# EAGLE design relay-set-d-decode (EAGLE 7.7.0)
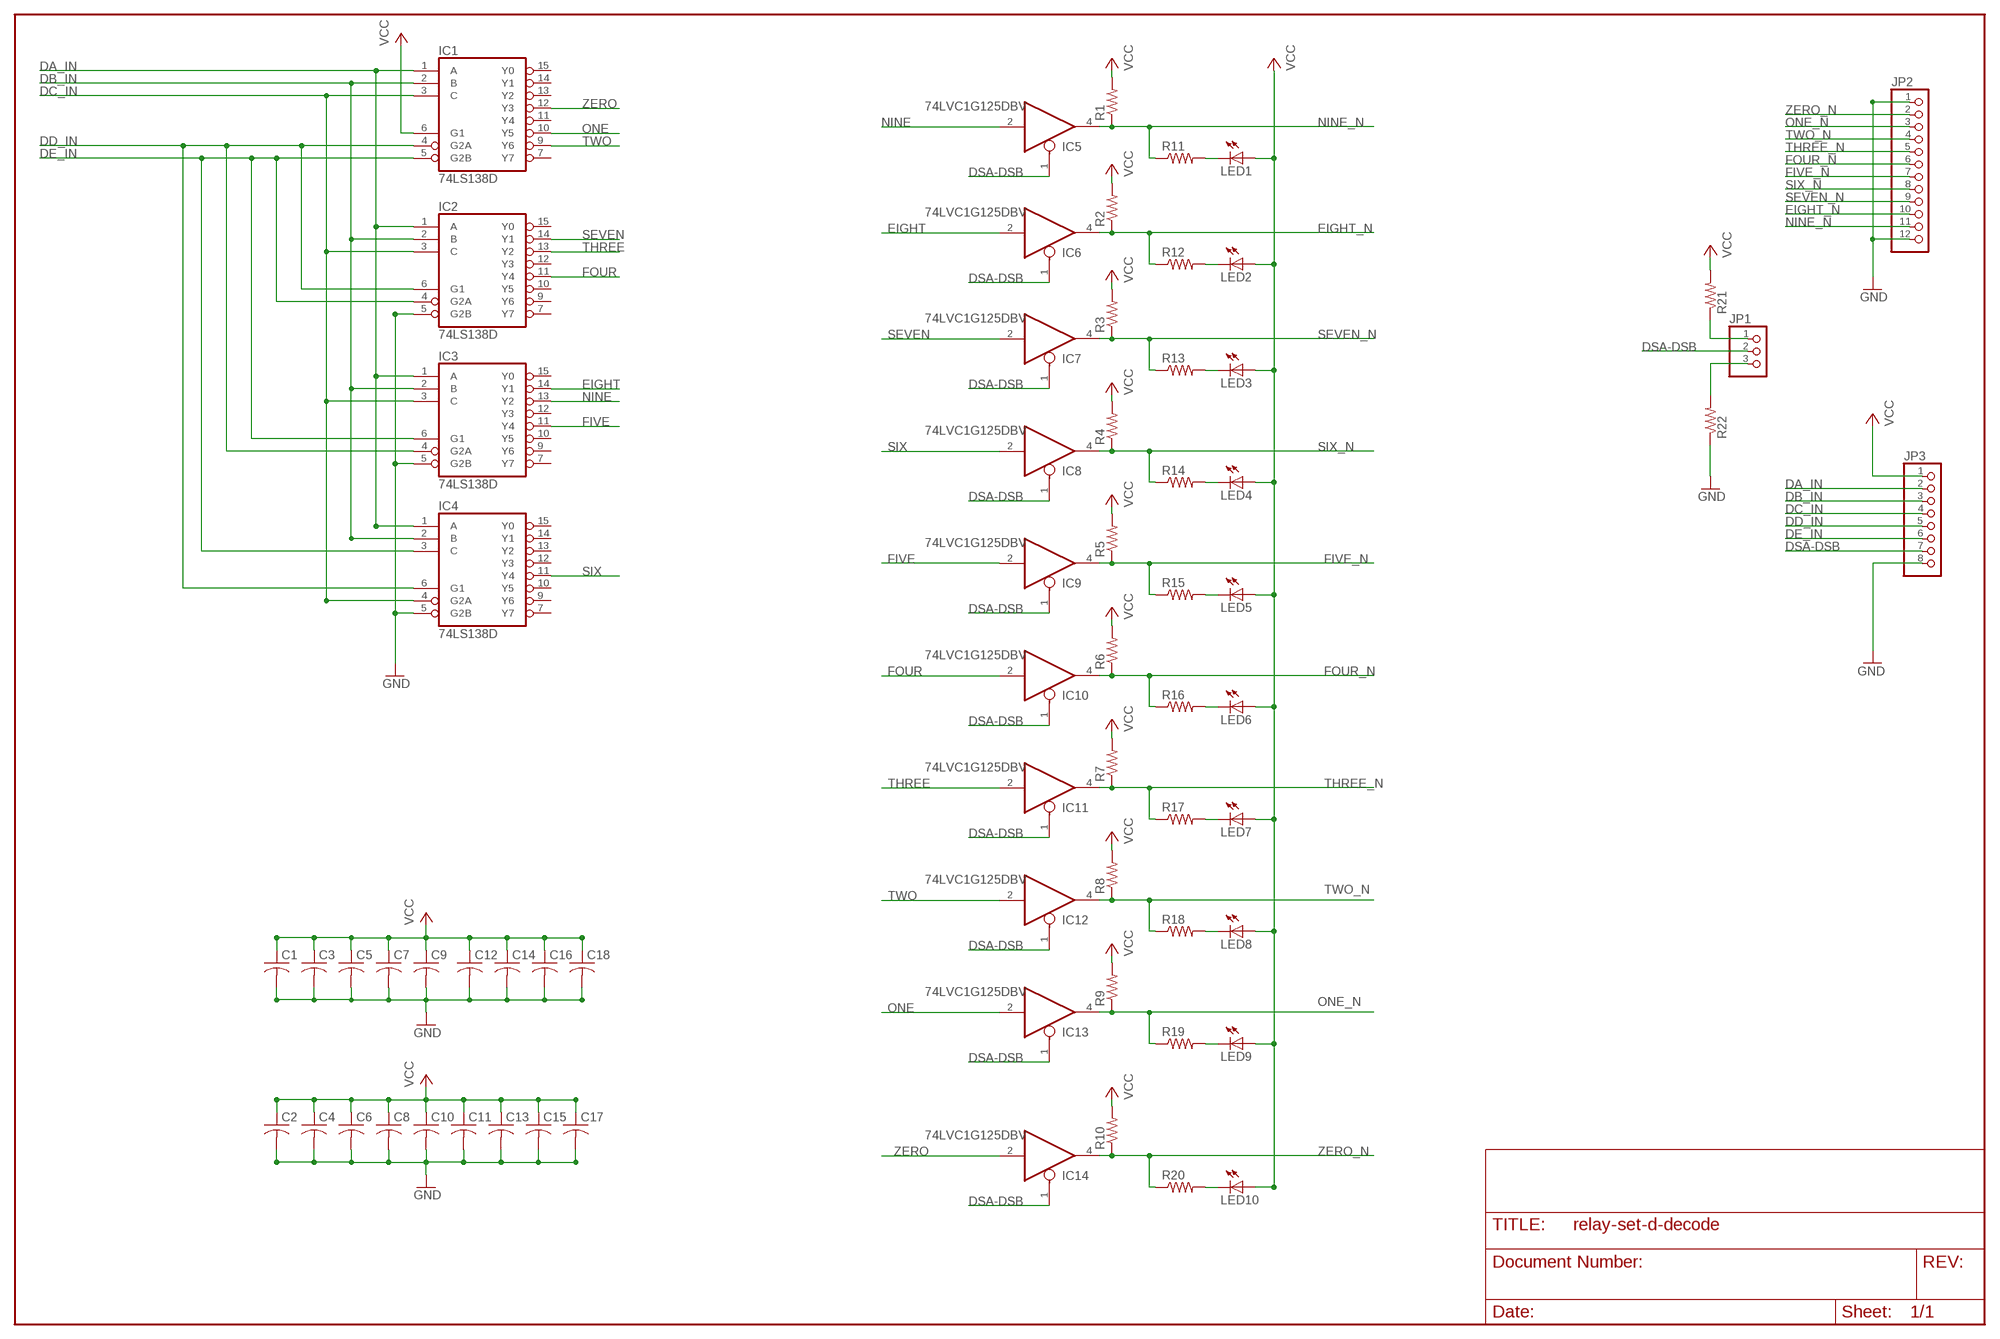
[diagram p0: schematic, sheet 1]

## Parts
C1  C-USC0603  [C0603]
C2  C-USC0603  [C0603]
C3  C-USC0603  [C0603]
C4  C-USC0603  [C0603]
C5  C-USC0805  [C0805]
C6  C-USC0603  [C0603]
C7  C-USC0805  [C0805]
C8  C-USC0603  [C0603]
C9  C-USC0805  [C0805]
C10  C-USC0603  [C0603]
C11  C-USC0603  [C0603]
C12  C-USC0603  [C0603]
C13  C-USC0603  [C0603]
C14  C-USC0603  [C0603]
C15  C-USC0603  [C0603]
C16  C-USC0603  [C0603]
C17  C-USC0603  [C0603]
C18  C-USC0603  [C0603]
IC1  74LS138D  [SO16]
IC2  74LS138D  [SO16]
IC3  74LS138D  [SO16]
IC4  74LS138D  [SO16]
IC5  74LVC1G125DBV  [SOT23-5]
IC6  74LVC1G125DBV  [SOT23-5]
IC7  74LVC1G125DBV  [SOT23-5]
IC8  74LVC1G125DBV  [SOT23-5]
IC9  74LVC1G125DBV  [SOT23-5]
IC10  74LVC1G125DBV  [SOT23-5]
IC11  74LVC1G125DBV  [SOT23-5]
IC12  74LVC1G125DBV  [SOT23-5]
IC13  74LVC1G125DBV  [SOT23-5]
IC14  74LVC1G125DBV  [SOT23-5]
JP1  PINHD-1X3  [1X03]
JP2  PINHD-1X12  [1X12]
JP3  PINHD-1X8  [1X08]
LED1  LEDCHIP-LED0805  [CHIP-LED0805]
LED2  LEDCHIP-LED0805  [CHIP-LED0805]
LED3  LEDCHIP-LED0805  [CHIP-LED0805]
LED4  LEDCHIP-LED0805  [CHIP-LED0805]
LED5  LEDCHIP-LED0805  [CHIP-LED0805]
LED6  LEDCHIP-LED0805  [CHIP-LED0805]
LED7  LEDCHIP-LED0805  [CHIP-LED0805]
LED8  LEDCHIP-LED0805  [CHIP-LED0805]
LED9  LEDCHIP-LED0805  [CHIP-LED0805]
LED10  LEDCHIP-LED0805  [CHIP-LED0805]
R1  R-US_R0805  [R0805]
R2  R-US_R0805  [R0805]
R3  R-US_R0805  [R0805]
R4  R-US_R0805  [R0805]
R5  R-US_R0805  [R0805]
R6  R-US_R0805  [R0805]
R7  R-US_R0805  [R0805]
R8  R-US_R0805  [R0805]
R9  R-US_R0805  [R0805]
R10  R-US_R0805  [R0805]
R11  R-US_R0805  [R0805]
R12  R-US_R0805  [R0805]
R13  R-US_R0805  [R0805]
R14  R-US_R0805  [R0805]
R15  R-US_R0805  [R0805]
R16  R-US_R0805  [R0805]
R17  R-US_R0805  [R0805]
R18  R-US_R0805  [R0805]
R19  R-US_R0805  [R0805]
R20  R-US_R0805  [R0805]
R21  R-US_R0805  [R0805]
R22  R-US_R0805  [R0805]

## Nets
DA_IN: IC1.1(A) IC2.1(A) IC3.1(A) IC4.1(A) JP3.2
DB_IN: IC1.2(B) IC2.2(B) IC3.2(B) IC4.2(B) JP3.3
DC_IN: IC1.3(C) IC2.3(C) IC3.3(C) IC4.4(G2A) JP3.4
DD_IN: IC1.4(G2A) IC2.6(G1) IC3.4(G2A) IC4.6(G1) JP3.5
DE_IN: IC1.5(G2B) IC2.4(G2A) IC3.6(G1) IC4.3(C) JP3.6
DSA-DSB: IC5.1(OE) IC6.1(OE) IC7.1(OE) IC8.1(OE) IC9.1(OE) IC10.1(OE) IC11.1(OE) IC12.1(OE) IC13.1(OE) IC14.1(OE) JP1.2 JP3.7
EIGHT: IC3.14(Y1) IC6.2(I)
EIGHT_N: IC6.4(O) JP2.10 R2.1 R12.1
FIVE: IC3.11(Y4) IC9.2(I)
FIVE_N: IC9.4(O) JP2.7 R5.1 R15.1
FOUR: IC2.11(Y4) IC10.2(I)
FOUR_N: IC10.4(O) JP2.6 R6.1 R16.1
GND: C1.2 C2.2 C3.2 C4.2 C5.2 C6.2 C7.2 C8.2 C9.2 C10.2 C11.2 C12.2 C13.2 C14.2 C15.2 C16.2 C17.2 C18.2 IC2.5(G2B) IC3.5(G2B) IC4.5(G2B) JP2.1 JP2.12 JP3.8 R22.1
N$1: LED1.C R11.2
N$2: LED2.C R12.2
N$3: LED3.C R13.2
N$4: LED4.C R14.2
N$5: LED5.C R15.2
N$6: LED6.C R16.2
N$7: LED7.C R17.2
N$8: LED8.C R18.2
N$9: LED9.C R19.2
N$10: LED10.C R20.2
N$11: JP1.1 R21.1
N$13: JP1.3 R22.2
NINE: IC3.13(Y2) IC5.2(I)
NINE_N: IC5.4(O) JP2.11 R1.1 R11.1
ONE: IC1.10(Y5) IC13.2(I)
ONE_N: IC13.4(O) JP2.3 R9.1 R19.1
SEVEN: IC2.14(Y1) IC7.2(I)
SEVEN_N: IC7.4(O) JP2.9 R3.1 R13.1
SIX: IC4.11(Y4) IC8.2(I)
SIX_N: IC8.4(O) JP2.8 R4.1 R14.1
THREE: IC2.13(Y2) IC11.2(I)
THREE_N: IC11.4(O) JP2.5 R7.1 R17.1
TWO: IC1.9(Y6) IC12.2(I)
TWO_N: IC12.4(O) JP2.4 R8.1 R18.1
VCC: C1.1 C2.1 C3.1 C4.1 C5.1 C6.1 C7.1 C8.1 C9.1 C10.1 C11.1 C12.1 C13.1 C14.1 C15.1 C16.1 C17.1 C18.1 IC1.6(G1) JP3.1 LED1.A LED2.A LED3.A LED4.A LED5.A LED6.A LED7.A LED8.A LED9.A LED10.A R1.2 R2.2 R3.2 R4.2 R5.2 R6.2 R7.2 R8.2 R9.2 R10.2 R21.2
ZERO: IC1.12(Y3) IC14.2(I)
ZERO_N: IC14.4(O) JP2.2 R10.1 R20.1
Unconnected: IC1.7(Y7) IC1.11(Y4) IC1.13(Y2) IC1.14(Y1) IC1.15(Y0) IC2.7(Y7) IC2.9(Y6) IC2.10(Y5) IC2.12(Y3) IC2.15(Y0) IC3.7(Y7) IC3.9(Y6) IC3.10(Y5) IC3.12(Y3) IC3.15(Y0) IC4.7(Y7) IC4.9(Y6) IC4.10(Y5) IC4.12(Y3) IC4.13(Y2) IC4.14(Y1) IC4.15(Y0)

## Power pins joined to a net without a drawn wire
GND: IC1.8(GND) IC2.8(GND) IC3.8(GND) IC4.8(GND) IC5.3(GND) IC6.3(GND) IC7.3(GND) IC8.3(GND) IC9.3(GND) IC10.3(GND) IC11.3(GND) IC12.3(GND) IC13.3(GND) IC14.3(GND)
VCC: IC1.16(VCC) IC2.16(VCC) IC3.16(VCC) IC4.16(VCC) IC5.5(VCC) IC6.5(VCC) IC7.5(VCC) IC8.5(VCC) IC9.5(VCC) IC10.5(VCC) IC11.5(VCC) IC12.5(VCC) IC13.5(VCC) IC14.5(VCC)

## Library data of the parts
C1-C18 = resistor:C-US: CAPACITOR, American symbol
IC1-IC4 = 74xx-us:74*138: 3-line to 8-line DECODER/DEMULTIPLEXER
IC5-IC14 = 74xx-little-us:74*1G125: Single Bus Buffer Gate with 3-State Output
JP1 = pinhead:PINHD-1X3: PIN HEADER
JP2 = custom-pinhead:PINHD-1X12: PIN HEADER
JP3 = pinhead:PINHD-1X8: PIN HEADER
LED1-LED10 = led:LED: LED OSRAM: - CHIPLED LG R971, LG N971, LY N971, LG Q971, LY Q971, LO R971, LY R971 LH N974, LH R974 LS Q976, LO Q976, LY Q976 LO Q996 - Hyper CHIPLED LW Q18S LB Q993, LB Q99A, LB R99A - SideLED LS A670, LO A670, LY A670, LG A670, LP A670 LB A673, LV A673, LT A673, LW A673 LH A674 LY A675 LS A676, LA A676, LO A676, LY A676, LW A676 LS A679, LY A679, LG A679 - Hyper Micro SIDELED® LS Y876, LA Y876, LO Y876, LY Y876 LT Y87S - SmartLED LW L88C, LW L88S LB L89C, LB L89S, LG L890 LS L89K, LO L89K, LY L89K LS L896, LA L896, LO L896, LY L896 - TOPLED LS T670, LO T670, LY T670, LG T670, LP T670 LSG T670, LSP T670, LSY T670, LOP T670, LYG T670 LG T671, LOG T671, LSG T671 LB T673, LV T673, LT T673, LW T673 LH T674 LS T676, LA T676, LO T676, LY T676, LB T676, LH T676, LSB T676, LW T676 LB T67C, LV T67C, LT T67C, LS T67K, LO T67K, LY T67K, LW E67C LS E67B, LA E67B, LO E67B, LY E67B, LB E67C, LV E67C, LT E67C LW T67C LS T679, LY T679, LG T679 LS T770, LO T770, LY T770, LG T770, LP T770 LB T773, LV T773, LT T773, LW T773 LH T774 LS E675, LA E675, LY E675, LS T675 LS T776, LA T776, LO T776, LY T776, LB T776 LHGB T686 LT T68C, LB T68C - Hyper Mini TOPLED® LB M676 - Mini TOPLED Santana® LG M470 LS M47K, LO M47K, LY M47K Source: http://www.osram.convergy.de LUXEON: - LUMILED® LXK2-PW12-R00, LXK2-PW12-S00, LXK2-PW14-U00, LXK2-PW14-V00 LXK2-PM12-R00, LXK2-PM12-S00, LXK2-PM14-U00 LXK2-PE12-Q00, LXK2-PE12-R00, LXK2-PE12-S00, LXK2-PE14-T00, LXK2-PE14-U00 LXK2-PB12-K00, LXK2-PB12-L00, LXK2-PB12-M00, LXK2-PB14-N00, LXK2-PB14-P00, LXK2-PB14-Q00 LXK2-PR12-L00, LXK2-PR12-M00, LXK2-PR14-Q00, LXK2-PR14-R00 LXK2-PD12-Q00, LXK2-PD12-R00, LXK2-PD12-S00 LXK2-PH12-R00, LXK2-PH12-S00 LXK2-PL12-P00, LXK2-PL12-Q00, LXK2-PL12-R00 Source: www.luxeon.com KINGBRIGHT: KA-3528ASYC Source: www.kingbright.com
R1-R22 = resistor:R-US_: RESISTOR, American symbol

## Board
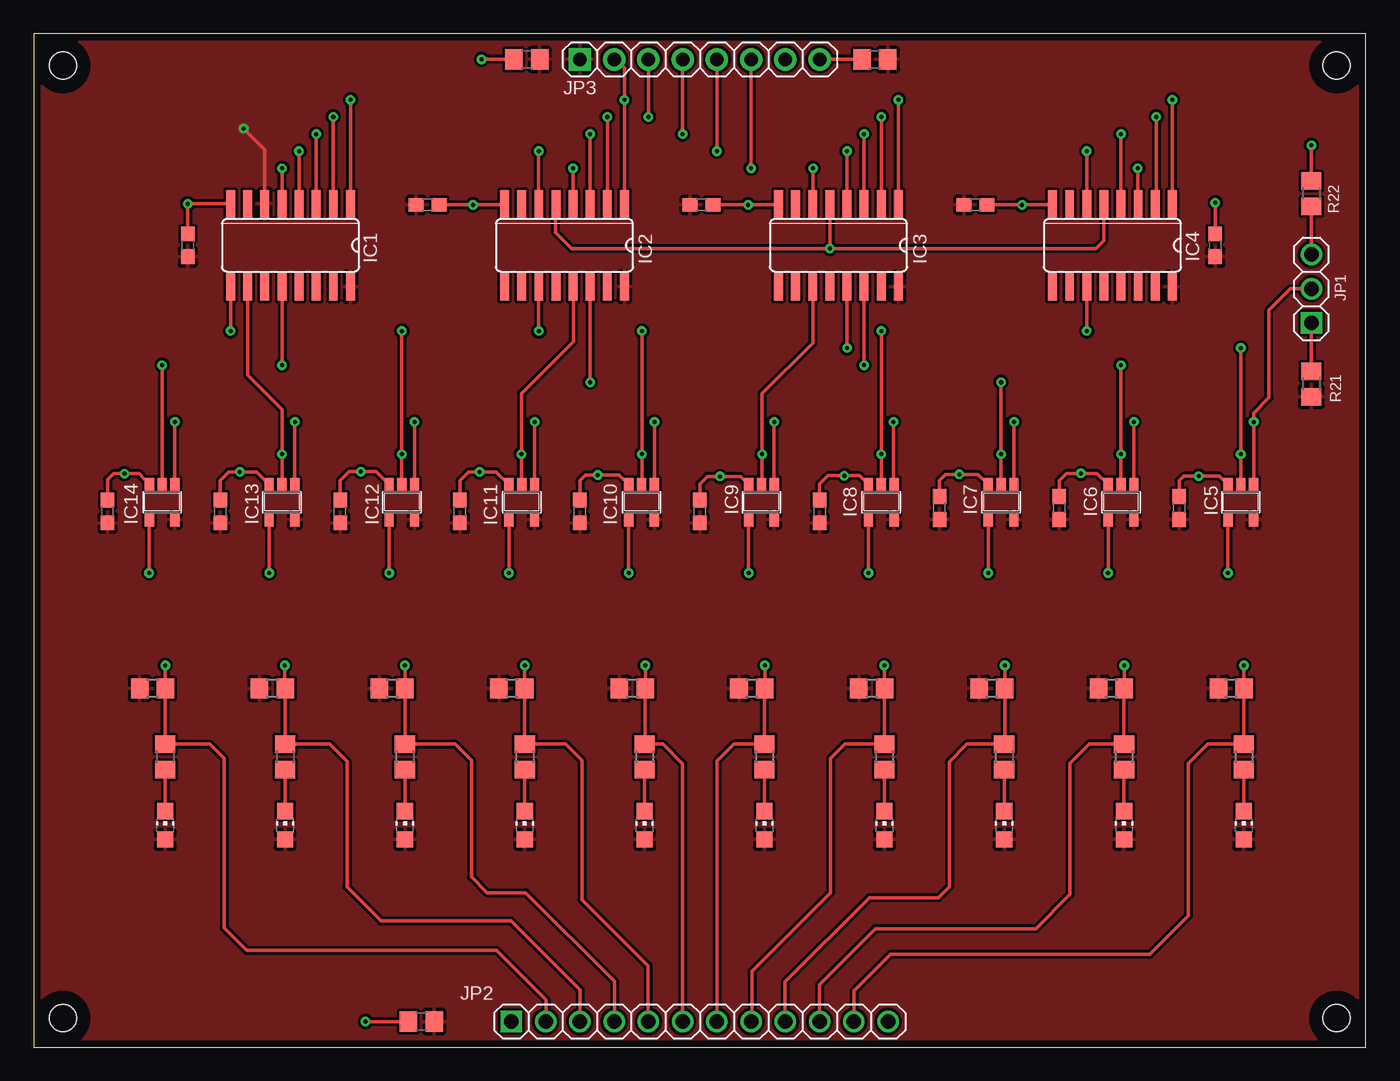
[diagram p1: board, top side]
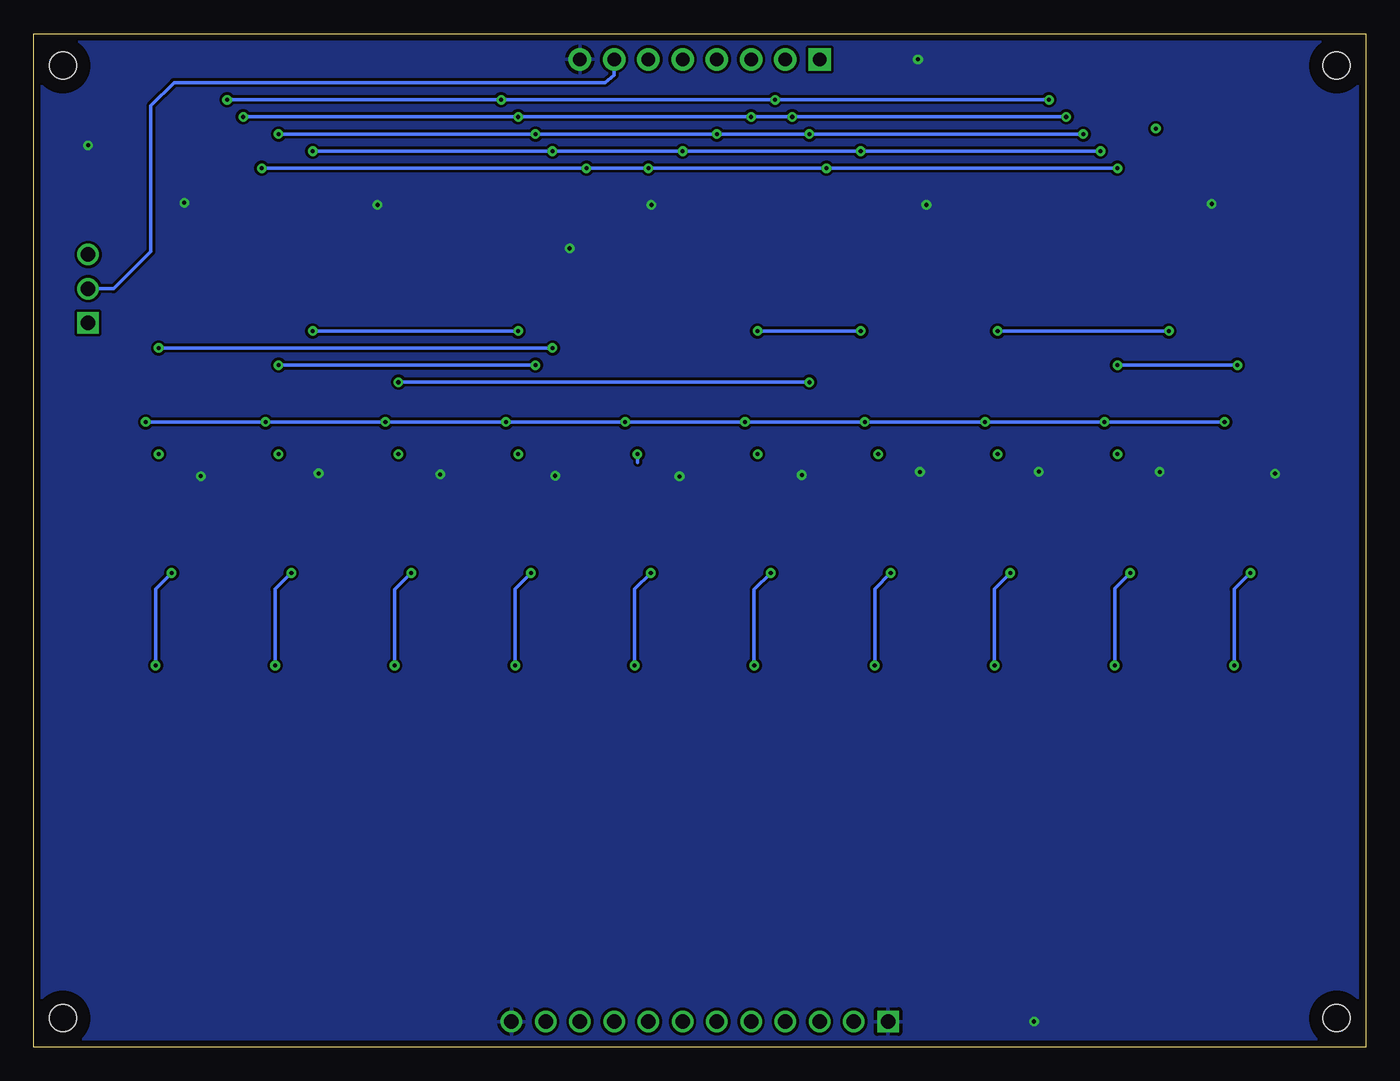
[diagram p2: board, bottom side, seen from below]

Size 98.81 x 75.18 mm. Coordinates in mm from the lower left corner, seen from the top.
Outline: 98.81,75.18 0,75.18 0,0 98.81,0 98.81,75.18
Copper layers (1*16): Top 0.035mm / dielectric 1.5mm / Bottom 0.035mm
Design rules "default *": minimum track width 8mil, minimum drill 12mil, track to track 8mil, track to pad 10mil, pad to pad 10mil, via to via 8mil, smd to smd 8mil, copper to edge 20mil, drill to drill 8mil, minimum pad ring 10mil, minimum via ring 8mil, stop-mask expansion 4mil, vias tented up to drill 0mil, thermal gap 10mil
Holes 2.01 mm at 2.16,2.16 96.65,2.16 96.65,72.82 2.16,72.82
tRestrict: area 94.6,0.2 to 98.7,4.2; area 94.6,70.8 to 98.7,74.8; area 0.2,70.8 to 4.2,74.8; area 0.2,0.2 to 4.2,4.2
bRestrict: area 94.6,0.2 to 98.7,4.2; area 94.6,70.8 to 98.7,74.8; area 0.2,70.8 to 4.2,74.8; area 0.2,0.2 to 4.2,4.2

### Footprints (pad centres in the part's own frame; a part is rotated, then mirrored left to right if it is on the bottom)
C0603 = smd 1.1 x 1: 1 -0.85,0; 2 0.85,0
C0805 = smd 1.3 x 1.5: 1 -0.95,0; 2 0.95,0
SO16 = smd 0.66 x 2.032: 1 -4.445,-3.073; 2 -3.175,-3.073; 3 -1.905,-3.073; 4 -0.635,-3.073; 5 0.635,-3.073; 6 1.905,-3.073; 7 3.175,-3.073; 8 4.445,-3.073; 9 4.445,3.073; 10 3.175,3.073; 11 1.905,3.073; 12 0.635,3.073; 13 -0.635,3.073; 14 -1.905,3.073; 15 -3.175,3.073; 16 -4.445,3.073
SOT23-5 = smd 0.69 x 0.99: 1 -0.95,-1.29; 2 0,-1.29; 3 0.95,-1.29; 4 0.95,1.3; 5 -0.95,1.3
1X03 = drill 1.067 square: 1 -2.54,0 | drill 1.067: 2 0,0; 3 2.54,0
1X12 = drill 1.067 square: 1 -13.97,0 | drill 1.067: 2 -11.43,0; 3 -8.89,0; 4 -6.35,0; 5 -3.81,0; 6 -1.27,0; 7 1.27,0; 8 3.81,0; 9 6.35,0; 10 8.89,0; 11 11.43,0; 12 13.97,0
1X08 = drill 1.016 pad 1.676 square: 1 -8.89,0 | drill 1.016 pad 1.676: 2 -6.35,0; 3 -3.81,0; 4 -1.27,0; 5 1.27,0; 6 3.81,0; 7 6.35,0; 8 8.89,0
CHIP-LED0805 = smd 1.2 x 1.2: A 0,-1.05; C 0,1.05
R0805 = smd 1.3 x 1.5: 1 -0.95,0; 2 0.95,0

### Placement (x,y rotation side)
C1  29.21,62.48 0 top
C2  87.63,59.49 90 top
C3  49.53,62.48 0 top
C4  69.85,62.48 0 top
C5  36.58,73.28 180 top
C6  49.4,39.75 90 top
C7  62.41,73.28 180 top
C8  58.29,39.75 90 top
C9  28.75,1.91 180 top
C10  67.18,40.01 90 top
C11  76.07,40.01 90 top
C12  5.49,39.75 90 top
C13  84.96,40.01 90 top
C14  13.84,39.75 90 top
C15  31.62,39.75 90 top
C16  22.73,39.75 90 top
C17  40.51,39.75 90 top
C18  11.43,59.49 90 top
IC1  19.05,59.49 180 top
IC2  39.37,59.49 180 top
IC3  59.69,59.49 180 top
IC4  80.01,59.49 180 top
IC5  89.53,40.44 180 top
IC6  80.64,40.44 180 top
IC7  71.75,40.44 180 top
IC8  62.87,40.44 180 top
IC9  53.98,40.44 180 top
IC10  45.09,40.44 180 top
IC11  36.2,40.44 180 top
IC12  27.3,40.44 180 top
IC13  18.41,40.44 180 top
IC14  9.53,40.44 180 top
JP1  94.77,56.26 90 top
JP2  49.4,1.91 0 top
JP3  49.4,73.28 0 top
LED1  89.76,16.46 0 top
LED2  80.87,16.46 0 top
LED3  71.98,16.46 0 top
LED4  63.09,16.46 0 top
LED5  54.2,16.46 0 top
LED6  45.31,16.46 0 top
LED7  36.42,16.46 0 top
LED8  27.53,16.46 0 top
LED9  18.64,16.46 0 top
LED10  9.75,16.46 0 top
R1  88.82,26.62 180 top
R2  79.93,26.62 180 top
R3  71.07,26.62 180 top
R4  62.15,26.62 180 top
R5  53.26,26.62 180 top
R6  44.4,26.62 180 top
R7  35.46,26.62 180 top
R8  26.59,26.62 180 top
R9  17.7,26.62 180 top
R10  8.81,26.62 180 top
R11  89.76,21.54 270 top
R12  80.87,21.54 270 top
R13  71.98,21.54 270 top
R14  63.09,21.54 270 top
R15  54.2,21.54 270 top
R16  45.31,21.54 270 top
R17  36.42,21.54 270 top
R18  27.53,21.54 270 top
R19  18.64,21.54 270 top
R20  9.75,21.54 270 top
R21  94.77,49.2 270 top
R22  94.77,63.32 270 top

### Tracks (layer width: path | path; a pad name or v marks a point on that pad's centre or on a via)
DA_IN  (via drill 0.3)
  Top 0.254: IC1.1 v23.5,70.28 | v84.45,70.28 IC4.1 | IC2.1 v43.81,70.28 43.81,72.64 JP3.2 | IC3.1 v64.14,70.28
  Bottom 0.254: v23.5,70.28 v43.81,70.28 v64.14,70.28 v84.45,70.28
DB_IN  (via drill 0.3)
  Top 0.254: IC1.2 v22.23,69.01 | v83.26,69.01 83.26,62.56 IC4.2 | IC2.2 v42.55,69.01 | IC3.2 v62.87,69.01 | JP3.3 v45.59,69.01
  Bottom 0.254: v22.23,69.01 v42.55,69.01 v45.59,69.01 v62.87,69.01 v83.26,69.01
DC_IN  (via drill 0.3)
  Top 0.254: IC1.3 v20.95,67.74 | IC3.3 v61.59,67.74 | JP3.4 v48.13,67.74 | IC4.4 v80.64,67.74 | IC2.3 v41.27,67.74
  Bottom 0.254: v20.95,67.74 v41.27,67.74 v48.13,67.74 v61.59,67.74 v80.64,67.74
DD_IN  (via drill 0.3)
  Top 0.254: IC1.4 v19.68,66.47 | IC2.6 v37.47,66.47 | JP3.5 v50.67,66.47 | IC4.6 v78.11,66.47 | IC3.4 v60.33,66.47
  Bottom 0.254: v19.68,66.47 v37.47,66.47 v50.67,66.47 v60.33,66.47 v78.11,66.47
DE_IN  (via drill 0.3)
  Top 0.254: IC1.5 v18.41,65.2 | IC2.4 v40.01,65.2 | IC3.6 57.78,65.18 v57.81,65.2 | JP3.6 v53.21,65.2 | IC4.3 81.89,62.59 v81.89,65.2
  Bottom 0.254: v18.41,65.2 v40.01,65.2 v53.21,65.2 v57.81,65.2 v81.89,65.2
DSA-DSB  (via drill 0.3)
  Top 0.254: IC14.1 v10.47,46.38 | 90.5,41.73 IC5.1 90.48,46.37 | IC13.1 19.36,46.38 v19.38,46.38 | IC12.1 28.25,46.38 v28.25,46.38 | IC11.1 37.15,46.38 v37.16,46.38 | IC10.1 46.03,46.37 v46.05,46.38 | IC9.1 54.92,46.37 v54.94,46.38 | IC8.1 63.78,41.76 v63.78,46.38 | IC7.1 72.7,46.38 v72.72,46.38 | IC6.1 81.59,46.38 v81.61,46.38 | 90.48,46.37 v90.5,46.38 | 90.48,46.37 90.48,47.05 91.62,48.18 91.62,54.69 93.19,56.26 JP1.2
  Bottom 0.254: v10.47,46.38 v19.38,46.38 v28.25,46.38 v37.16,46.38 v46.05,46.38 v54.94,46.38 v63.78,46.38 v72.72,46.38 v81.61,46.38 v90.5,46.38 | JP3.7 55.75,72.11 56.44,71.55 88.39,71.55 90.12,69.83 90.12,59.03 92.89,56.26 JP1.2
EIGHT  (via drill 0.3)
  Top 0.254: IC3.14 v61.59,50.6 | IC6.2 v80.64,43.99 v80.64,50.6
  Bottom 0.254: v80.64,50.6 v61.59,50.6
EIGHT_N  (via drill 0.3)
  Top 0.254: 81.42,22.5 R12.1 | IC6.4 v79.69,35.18 | v80.9,28.32 80.9,26.63 R2.1 R12.1 | R12.1 78.29,22.49 76.86,21.06 76.86,11.33 74.32,8.79 62.43,8.79 58.29,4.65 JP2.10
  Bottom 0.254: v79.69,35.18 80.9,33.98 v80.9,28.32
FIVE  (via drill 0.3)
  Top 0.254: IC9.2 54.03,41.78 v54.03,43.99 54.03,48.49 57.78,52.25 IC3.11 57.76,56.39
  Bottom 0.254: v54.03,43.99 54,43.38
FIVE_N  (via drill 0.3)
  Top 0.254: IC9.4 53.02,35.27 v53.03,35.18 | v54.23,28.32 54.23,26.63 R5.1 R15.1 51.95,22.49 50.7,21.23 50.7,1.93 JP2.7
  Bottom 0.254: v53.03,35.18 54.23,33.98 v54.23,28.32
FOUR  (via drill 0.3)
  Top 0.254: IC2.11 v37.47,53.14 | v45.11,53.14 v45.11,43.99 45.11,41.73 IC10.2
  Bottom 0.254: v37.47,53.14 v45.11,53.14
FOUR_N  (via drill 0.3)
  Top 0.254: v44.13,35.18 IC10.4 | v45.36,28.32 45.36,26.63 R6.1 45.35,22.52 R16.1 46.67,22.49 48.13,21.03 JP2.6
  Bottom 0.254: v44.13,35.18 45.36,33.95 v45.36,28.32
GND  (via drill 0.3, 0.3 pad 0.41)
  Top 0.254: IC13.3 16.52,42.67 v15.29,42.67 14.48,42.67 13.84,42.04 C14.2 | IC12.3 25.38,42.7 v24.26,42.7 23.39,42.7 22.73,42.04 C16.2 | IC14.3 7.83,42.55 v6.73,42.55 5.92,42.55 5.49,42.11 C12.2 | IC11.3 34.3,42.67 v33.07,42.67 32.26,42.67 31.62,42.04 C15.2 | IC10.3 43.42,42.44 v41.83,42.44 40.92,42.44 40.51,42.04 C17.2 | IC9.3 52.41,42.34 v50.9,42.34 49.96,42.34 49.4,41.78 C6.2 | IC8.3 61.25,42.39 v60.12,42.39 58.9,42.39 58.29,41.78 C8.2 | IC7.3 70.04,42.49 v68.66,42.49 67.64,42.49 67.18,42.04 C10.2 | IC6.3 78.85,42.57 v77.67,42.57 76.61,42.57 76.07,42.04 C11.2 | IC5.3 87.94,42.37 v86.41,42.37 85.29,42.37 84.96,42.04 C13.2 | IC4.5 79.38,59.84 78.79,59.26 v59.05,59.26 | v59.05,59.26 39.88,59.26 38.71,60.43 38.71,62.53 IC2.5 | IC3.5 v59.05,59.26 | IC1.8 v11.43,62.56 C18.2 | C1.2 v32.59,62.48 34.92,62.48 IC2.8 | C3.2 v52.98,62.48 55.24,62.48 IC3.8 | C4.2 v73.3,62.48 75.56,62.48 IC4.8 | C2.2 v87.63,62.64 | C5.2 v33.22,73.28 | C7.2 JP3.8 | C9.2 v24.61,1.91 | R22.1 v94.77,66.9
  Bottom 0.254: v68.66,42.49 68.56,42.6
  pour Bottom: 98.55,0.25 0.25,0.25 0.25,74.93 98.55,74.93
N$1
  Top 0.254: R11.2 LED1.C
N$2
  Top 0.254: R12.2 LED2.C
N$3
  Top 0.254: R13.2 LED3.C
N$4
  Top 0.254: R14.2 LED4.C
N$5
  Top 0.254: R15.2 LED5.C
N$6
  Top 0.254: R16.2 LED6.C
N$7
  Top 0.254: R17.2 LED7.C
N$8
  Top 0.254: R18.2 LED8.C
N$9
  Top 0.254: LED9.C R19.2
N$10
  Top 0.254: R20.2 LED10.C
N$11
  Top 0.254: JP1.1 R21.1
N$13
  Top 0.254: JP1.3 R22.2
NINE  (via drill 0.3)
  Top 0.254: IC3.13 v60.33,51.87 | v89.53,51.87 v89.53,43.99 IC5.2
  Bottom 0.254: v60.33,51.87 v89.53,51.87
NINE_N  (via drill 0.3)
  Top 0.254: v89.76,28.32 R1.1 89.77,22.5 R11.1 87.08,22.49 85.65,21.06 85.65,9.75 82.78,6.88 63.55,6.88 60.86,4.19 60.86,1.93 JP2.11 | IC5.4 v88.58,35.18
  Bottom 0.254: v88.58,35.18 89.76,34 v89.76,28.32
ONE  (via drill 0.3)
  Top 0.254: IC1.10 15.88,49.86 18.41,47.32 v18.41,43.99 IC13.2
ONE_N  (via drill 0.3 pad 0.41)
  Top 0.254: v18.62,28.32 18.62,26.66 R9.1 R19.1 21.96,22.49 23.24,21.21 23.24,11.89 25.76,9.37 35.41,9.37 40.54,4.24 40.54,1.93 JP2.3 | IC13.4 17.48,39.14 v17.48,35.18
  Bottom 0.254: v17.48,35.18 18.62,34.04 v18.62,28.32
SEVEN  (via drill 0.3)
  Top 0.254: IC2.14 v41.27,49.33 | v71.75,49.33 v71.75,43.99 IC7.2
  Bottom 0.254: v41.27,49.33 v71.75,49.33
SEVEN_N  (via drill 0.3)
  Top 0.254: v72.03,28.32 72.03,26.63 R3.1 72.02,22.52 R13.1 69.22,22.49 67.92,21.18 67.92,11.91 67.11,11.1 61.98,11.1 55.73,4.85 55.73,1.93 JP2.9 | IC7.4 v70.81,35.18
  Bottom 0.254: v70.81,35.18 72.03,33.95 v72.03,28.32
SIX  (via drill 0.3)
  Top 0.254: v62.87,53.14 v62.87,43.99 IC8.2 | IC4.11 v78.11,53.14
  Bottom 0.254: v78.11,53.14 v62.87,53.14
SIX_N  (via drill 0.3)
  Top 0.254: v63.09,28.32 R4.1 63.1,22.5 R14.1 60.16,22.49 59.11,21.44 59.11,11.46 53.26,5.61 53.26,1.96 JP2.8 | IC8.4 61.92,39.14 v61.92,35.18
  Bottom 0.254: v61.92,35.18 63.09,34.01 v63.09,28.32
THREE  (via drill 0.3)
  Top 0.254: 36.17,41.75 IC11.2 arc-90 36.17,41.75 | 36.17,41.75 v36.17,43.99 36.17,48.49 40.03,52.35 40.03,56.39 IC2.13
THREE_N  (via drill 0.3)
  Top 0.254: 36.42,26.63 R7.1 | 36.42,26.63 R17.1 39.44,22.49 40.66,21.26 40.66,10.95 45.57,6.04 45.57,1.93 JP2.5 | 36.42,26.63 v36.42,28.32 | IC11.4 v35.24,35.18
  Bottom 0.254: v35.24,35.18 36.42,34 v36.42,28.32
TWO  (via drill 0.3)
  Top 0.254: IC1.9 v14.61,53.14 | v27.3,53.14 v27.3,43.99 IC12.2
  Bottom 0.254: v14.61,53.14 v27.3,53.14
TWO_N  (via drill 0.3)
  Top 0.254: R8.1 R18.1 31.26,22.49 32.46,21.29 32.46,12.62 33.63,11.46 36.5,11.46 43.08,4.88 43.08,1.93 JP2.4 | R8.1 | R8.1 v27.53,28.32 | IC12.4 v26.36,35.18
  Bottom 0.254: v26.36,35.18 27.53,34.01 v27.53,28.32
VCC  (via drill 0.3)
  Top 0.254: IC1.6 17.14,66.57 v15.57,68.15
  pour Top (rank 2): 98.55,0.25 0.25,0.25 0.25,74.93 98.55,74.93
ZERO  (via drill 0.3)
  Top 0.254: IC1.12 v18.41,50.6 | v9.53,50.6 IC14.2
  Bottom 0.254: v18.41,50.6 v9.53,50.6
ZERO_N  (via drill 0.3 pad 0.41)
  Top 0.254: 9.73,26.66 R10.1 | JP2.2 38,1.93 38,3.5 34.31,7.19 15.8,7.19 14.12,8.87 14.12,21.41 13.04,22.49 R20.1 R10.1 | IC14.4 8.56,39.12 v8.56,35.18 | v9.76,28.32 R10.1
  Bottom 0.254: v8.56,35.18 9.76,33.98 v9.76,28.32

### Text on the board
Document: 0 | 1 | 2 | 3 | 4 | 5 | 6 | 7 | 8 | 9 | Relay Set D / Decode